# Altium schematic sheet PLBank13.SchDoc
size A4; SheetNumber: 9; SheetTotal: 18
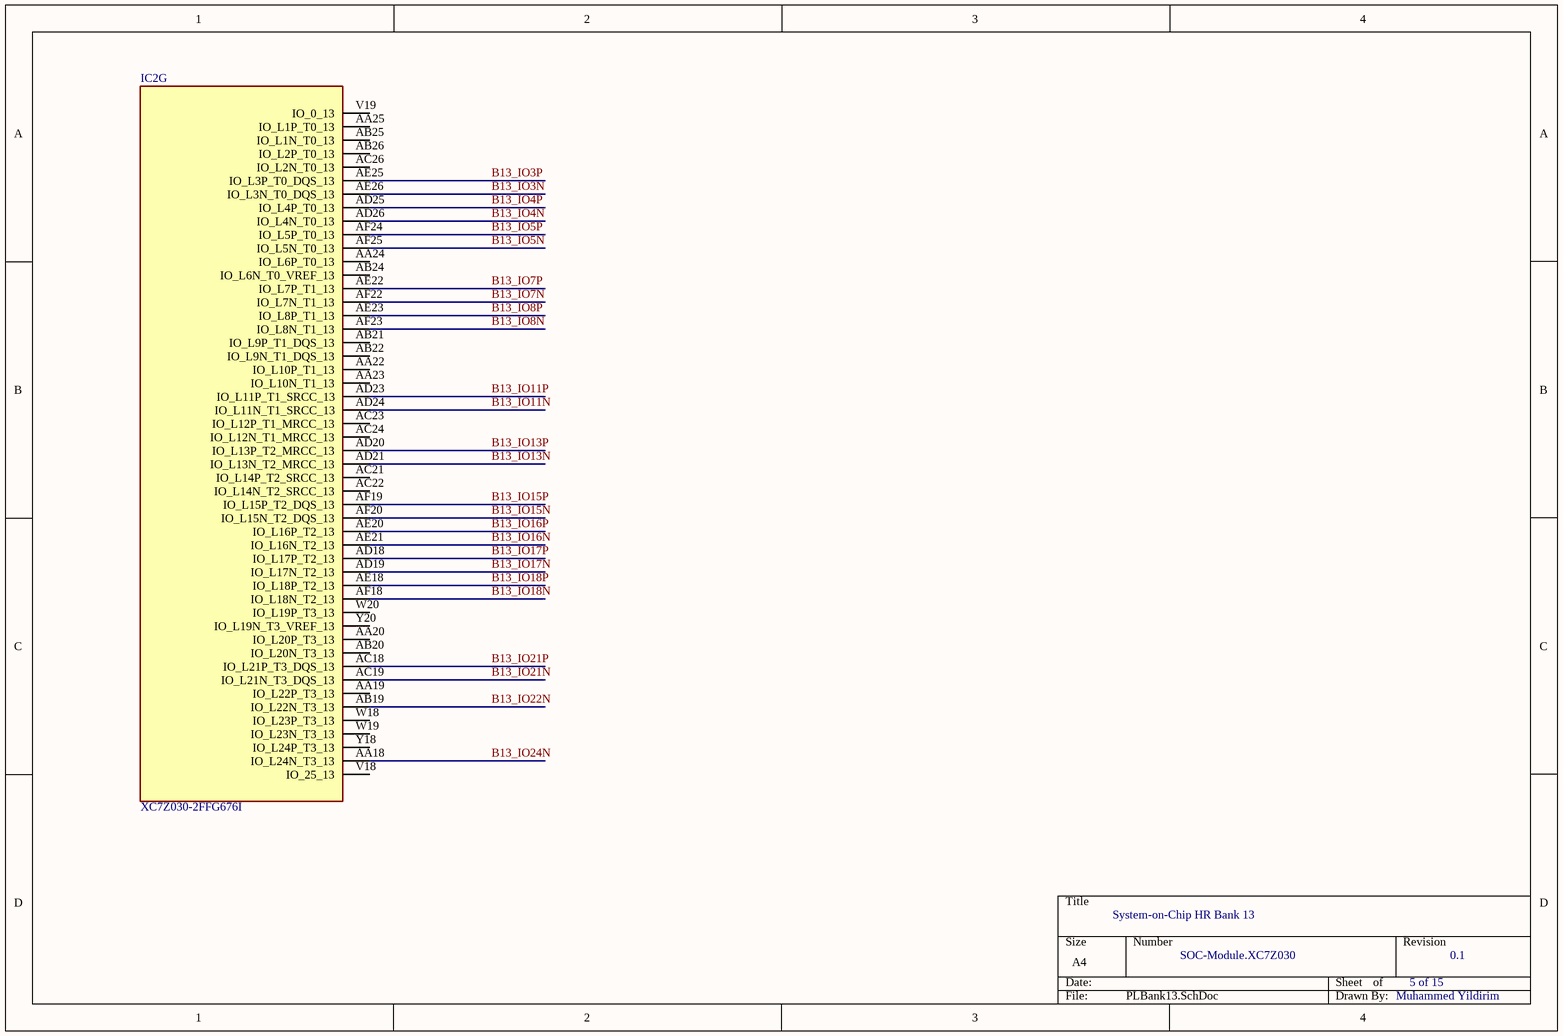
[diagram p0: PLBank13.SchDoc]

## Parts
IC2  XC7Z030-2FFG676I  [BGA676C100P26X26_2700X2700X324]  (part G of 15)

## Nets
B13_IO3N: IC2.AE26(IO_L3N_T0_DQS_13)
B13_IO3P: IC2.AE25(IO_L3P_T0_DQS_13)
B13_IO4N: IC2.AD26(IO_L4N_T0_13)
B13_IO4P: IC2.AD25(IO_L4P_T0_13)
B13_IO5N: IC2.AF25(IO_L5N_T0_13)
B13_IO5P: IC2.AF24(IO_L5P_T0_13)
B13_IO7N: IC2.AF22(IO_L7N_T1_13)
B13_IO7P: IC2.AE22(IO_L7P_T1_13)
B13_IO8N: IC2.AF23(IO_L8N_T1_13)
B13_IO8P: IC2.AE23(IO_L8P_T1_13)
B13_IO11N: IC2.AD24(IO_L11N_T1_SRCC_13)
B13_IO11P: IC2.AD23(IO_L11P_T1_SRCC_13)
B13_IO13N: IC2.AD21(IO_L13N_T2_MRCC_13)
B13_IO13P: IC2.AD20(IO_L13P_T2_MRCC_13)
B13_IO15N: IC2.AF20(IO_L15N_T2_DQS_13)
B13_IO15P: IC2.AF19(IO_L15P_T2_DQS_13)
B13_IO16N: IC2.AE21(IO_L16N_T2_13)
B13_IO16P: IC2.AE20(IO_L16P_T2_13)
B13_IO17N: IC2.AD19(IO_L17N_T2_13)
B13_IO17P: IC2.AD18(IO_L17P_T2_13)
B13_IO18N: IC2.AF18(IO_L18N_T2_13)
B13_IO18P: IC2.AE18(IO_L18P_T2_13)
B13_IO21N: IC2.AC19(IO_L21N_T3_DQS_13)
B13_IO21P: IC2.AC18(IO_L21P_T3_DQS_13)
B13_IO22N: IC2.AB19(IO_L22N_T3_13)
B13_IO24N: IC2.AA18(IO_L24N_T3_13)

Not connected (* = marked no-connect by the designer): IC2 AA19(IO_L22P_T3_13) AA20(IO_L20P_T3_13) AA22(IO_L10P_T1_13) AA23(IO_L10N_T1_13) AA24(IO_L6P_T0_13) AA25(IO_L1P_T0_13) AB20(IO_L20N_T3_13) AB21(IO_L9P_T1_DQS_13) AB22(IO_L9N_T1_DQS_13) AB24(IO_L6N_T0_VREF_13) AB25(IO_L1N_T0_13) AB26(IO_L2P_T0_13) AC21(IO_L14P_T2_SRCC_13) AC22(IO_L14N_T2_SRCC_13) AC23(IO_L12P_T1_MRCC_13) AC24(IO_L12N_T1_MRCC_13) AC26(IO_L2N_T0_13) V18(IO_25_13) V19(IO_0_13) W18(IO_L23P_T3_13) W19(IO_L23N_T3_13) W20(IO_L19P_T3_13) Y18(IO_L24P_T3_13) Y20(IO_L19N_T3_VREF_13)

## Notes on the sheet
- System-on-Chip HR Bank 13
- SOC-Module.XC7Z030
- 5 of 15
- 0.1
- Muhammed Yildirim

## Library data of the parts
IC2 = XC7Z030-2FFG676I: Integrated Circuit; Manufacturer_Name: AMD; Datasheet Link: http://www.xilinx.com/support/documentation/data_sheets/ds190-Zynq-7000-Overview.pdf; Height: 3.24mm; Manufacturer_Part_Number: XC7Z030-2FFG676I; Mouser Part Number: 217-XC7Z030-2FFG676I; Mouser Price/Stock: https://www.mouser.co.uk/ProductDetail/Xilinx/XC7Z030-2FFG676I?qs=rrS6PyfT74cuZK5O3CSpmw%3D%3D